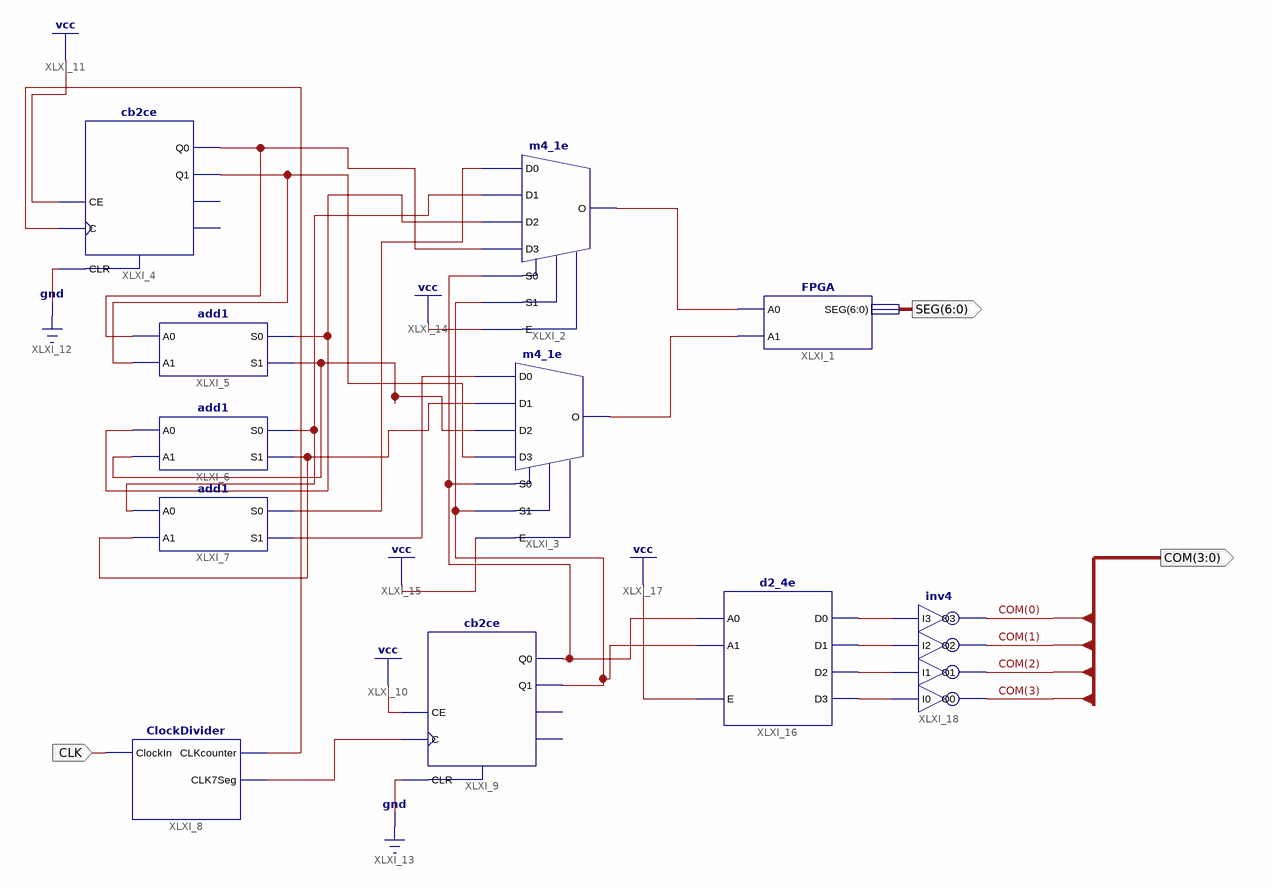
[diagram p0: schematic sheet 1]
// Xilinx ISE schematic main.sch (spartan6) as structural Verilog: 11 symbols, 3 ports
module main (
  input  CLK,
  output [6:0] SEG,
  output [3:0] COM
);

  wire XLXN_2, XLXN_3, XLXN_7, XLXN_10, XLXN_11, XLXN_12, XLXN_13, XLXN_14, XLXN_17, XLXN_19, XLXN_20,
       XLXN_28, XLXN_29, XLXN_33, XLXN_34, XLXN_35, XLXN_36, XLXN_42;

  FPGA XLXI_1 (.A0(XLXN_2), .A1(XLXN_3), .SEG(SEG));
  m4_1e XLXI_2 (
    .D0(XLXN_17), .D1(XLXN_14), .D2(XLXN_13), .D3(XLXN_11), .E(1'b1), .S0(XLXN_28), .S1(XLXN_29), .O(XLXN_2));
  m4_1e XLXI_3 (
    .D0(XLXN_42), .D1(XLXN_10), .D2(XLXN_7), .D3(XLXN_12), .E(1'b1), .S0(XLXN_28), .S1(XLXN_29), .O(XLXN_3));
  cb2ce XLXI_4 (.C(XLXN_19), .CE(1'b1), .CLR(1'b0), .Q0(XLXN_11), .Q1(XLXN_12));  // open: CEO, TC
  add1 XLXI_5 (.A0(XLXN_11), .A1(XLXN_12), .S0(XLXN_13), .S1(XLXN_7));
  add1 XLXI_6 (.A0(XLXN_13), .A1(XLXN_7), .S0(XLXN_14), .S1(XLXN_10));
  add1 XLXI_7 (.A0(XLXN_14), .A1(XLXN_10), .S0(XLXN_17), .S1(XLXN_42));
  ClockDivider XLXI_8 (.ClockIn(CLK), .CLK7Seg(XLXN_20), .CLKcounter(XLXN_19));
  cb2ce XLXI_9 (.C(XLXN_20), .CE(1'b1), .CLR(1'b0), .Q0(XLXN_28), .Q1(XLXN_29));  // open: CEO, TC
  d2_4e XLXI_16 (.A0(XLXN_28), .A1(XLXN_29), .E(1'b1), .D0(XLXN_33), .D1(XLXN_34), .D2(XLXN_35), .D3(XLXN_36));
  inv4 XLXI_18 (
    .I0(XLXN_36), .I1(XLXN_35), .I2(XLXN_34), .I3(XLXN_33), .O0(COM[3]), .O1(COM[2]), .O2(COM[1]), .O3(COM[0]));
endmodule
